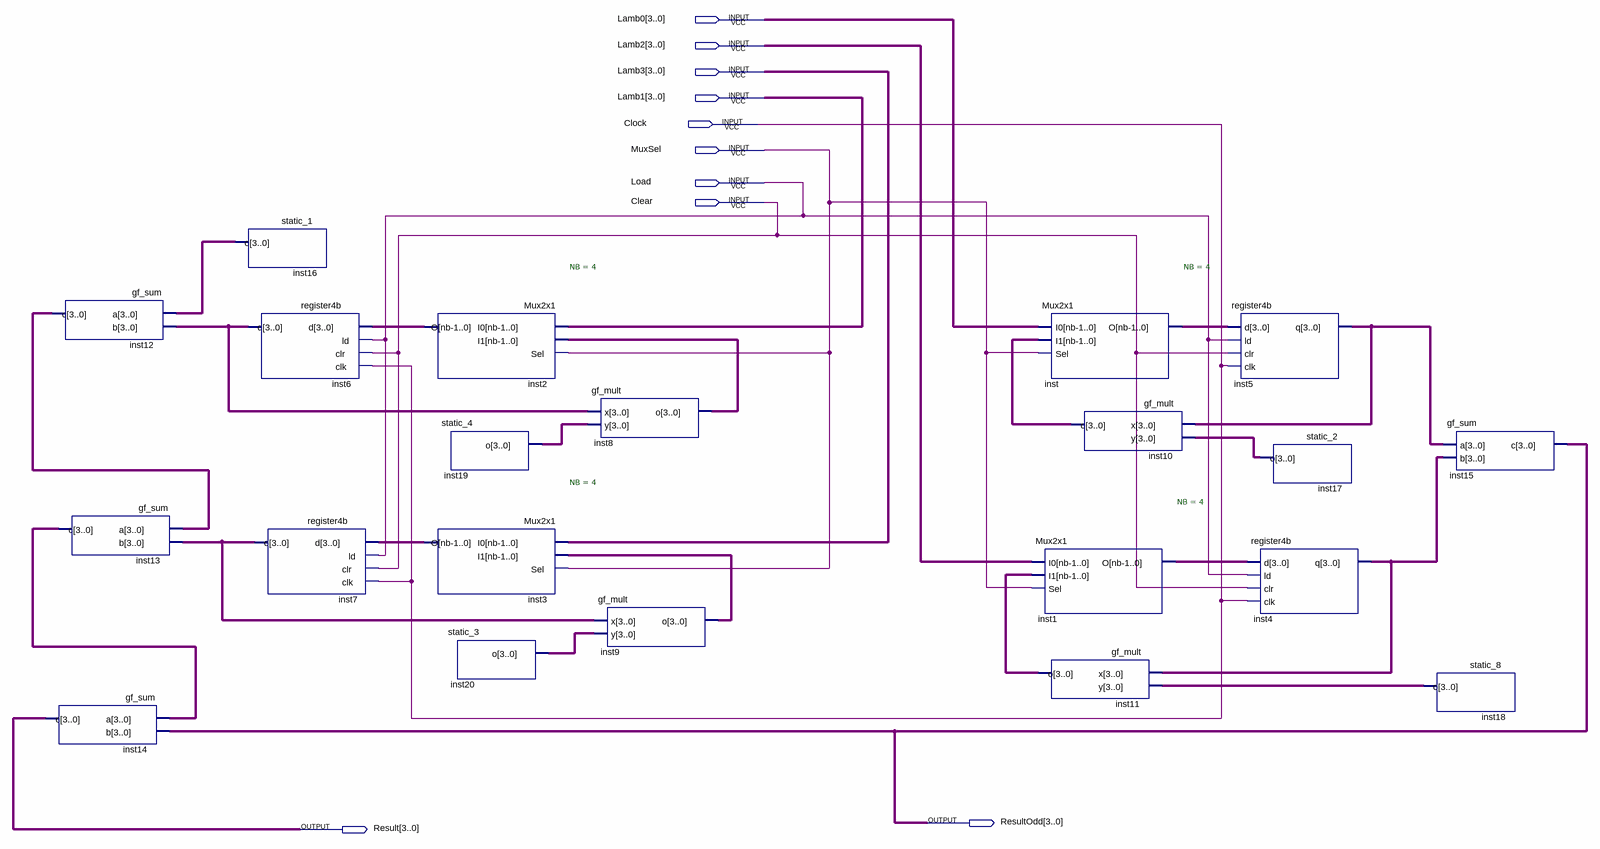
[diagram p0: schematic sheet]
// Quartus schematic Chien Search Location.bdf as structural Verilog: 21 symbols, 10 pins
module \Chien_Search_Location  (
  input  [3:0] Lamb0,
  input  [3:0] Lamb2,
  input  [3:0] Lamb3,
  input  [3:0] Lamb1,
  input  Clock,
  input  MuxSel,
  input  Load,
  input  Clear,
  output [3:0] ResultOdd,
  output [3:0] Result
);

  wire [3:0] inst1_o, inst2_o, inst3_o, inst4_q, inst5_q, inst6_q, inst7_q, inst8_o, inst9_o, inst10_o,
       inst11_o, inst12_c, inst13_c, inst16_o, inst17_o, inst18_o, inst19_o, inst20_o, inst_o;

  gf_sum inst12 (.a(inst16_o), .b(inst6_q), .c(inst12_c));
  gf_sum inst13 (.a(inst12_c), .b(inst7_q), .c(inst13_c));
  gf_sum inst14 (.a(inst13_c), .b(ResultOdd), .c(Result));
  static_1 inst16 (.o(inst16_o));
  register4b inst6 (.d(inst2_o), .ld(Load), .clr(Clear), .clk(Clock), .q(inst6_q));
  register4b inst7 (.d(inst3_o), .ld(Load), .clr(Clear), .clk(Clock), .q(inst7_q));
  Mux2x1 #(.NB(4)) inst2 (.I0(Lamb1), .I1(inst8_o), .Sel(MuxSel), .O(inst2_o));
  Mux2x1 #(.NB(4)) inst3 (.I0(Lamb3), .I1(inst9_o), .Sel(MuxSel), .O(inst3_o));
  static_4 inst19 (.o(inst19_o));
  static_3 inst20 (.o(inst20_o));
  gf_mult inst8 (.x(inst6_q), .y(inst19_o), .o(inst8_o));
  gf_mult inst9 (.x(inst7_q), .y(inst20_o), .o(inst9_o));
  Mux2x1 #(.NB(4)) inst (.I0(Lamb0), .I1(inst10_o), .Sel(MuxSel), .O(inst_o));
  Mux2x1 #(.NB(4)) inst1 (.I0(Lamb2), .I1(inst11_o), .Sel(MuxSel), .O(inst1_o));
  gf_mult inst11 (.x(inst4_q), .y(inst18_o), .o(inst11_o));
  gf_mult inst10 (.x(inst5_q), .y(inst17_o), .o(inst10_o));
  register4b inst5 (.d(inst_o), .ld(Load), .clr(Clear), .clk(Clock), .q(inst5_q));
  static_2 inst17 (.o(inst17_o));
  register4b inst4 (.d(inst1_o), .ld(Load), .clr(Clear), .clk(Clock), .q(inst4_q));
  gf_sum inst15 (.a(inst5_q), .b(inst4_q), .c(ResultOdd));
  static_8 inst18 (.o(inst18_o));
endmodule
